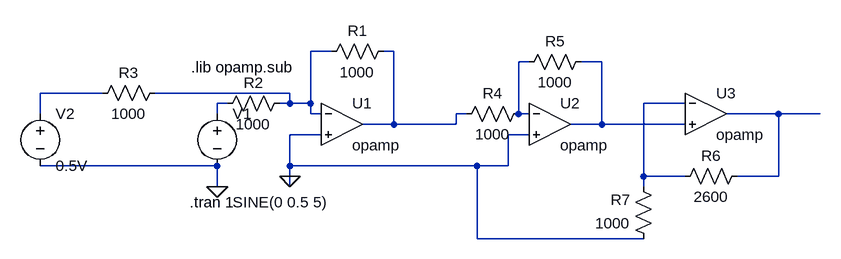
[diagram p0: schematic 3opamp_implementation.asc]
3opamp_implementation.asc, the LTspice schematic file:
Version 4
SHEET 1 932 680
WIRE 176 48 144 48
WIRE 272 48 256 48
WIRE 480 64 464 64
WIRE 592 64 560 64
WIRE -176 112 -272 112
WIRE 112 112 -96 112
WIRE 16 128 0 128
WIRE 112 128 112 112
WIRE 112 128 96 128
WIRE 144 128 144 48
WIRE 144 128 112 128
WIRE 720 128 656 128
WIRE -272 144 -272 112
WIRE 0 144 0 128
WIRE 144 144 144 128
WIRE 160 144 144 144
WIRE 384 144 368 144
WIRE 464 144 464 64
WIRE 480 144 464 144
WIRE 864 144 784 144
WIRE 928 144 864 144
WIRE 272 160 272 48
WIRE 272 160 224 160
WIRE 368 160 368 144
WIRE 368 160 272 160
WIRE 592 160 592 64
WIRE 592 160 544 160
WIRE 720 160 592 160
WIRE 160 176 112 176
WIRE 480 176 448 176
WIRE 0 224 -272 224
WIRE 112 224 112 176
WIRE 400 224 112 224
WIRE 448 224 448 176
WIRE 448 224 400 224
WIRE 112 240 112 224
WIRE 656 240 656 128
WIRE 720 240 656 240
WIRE 864 240 864 144
WIRE 864 240 800 240
WIRE 0 256 0 224
WIRE 112 256 112 240
WIRE 656 256 656 240
WIRE 400 336 400 224
WIRE 656 336 400 336
FLAG 0 256 0
FLAG 112 240 0
SYMBOL Opamps\\opamp 192 96 R0
SYMATTR InstName U1
SYMBOL voltage 0 128 R0
WINDOW 3 24 152 Left 2
WINDOW 123 24 124 Left 2
WINDOW 39 0 0 Left 0
SYMATTR InstName V1
SYMATTR Value SINE(0 0.5 5)
SYMBOL res 272 32 R90
WINDOW 0 0 56 VBottom 2
WINDOW 3 32 56 VTop 2
SYMATTR InstName R1
SYMATTR Value 1000
SYMBOL res 112 112 R90
WINDOW 0 0 56 VBottom 2
WINDOW 3 32 56 VTop 2
SYMATTR InstName R2
SYMATTR Value 1000
SYMBOL res -80 96 R90
WINDOW 0 0 56 VBottom 2
WINDOW 3 32 56 VTop 2
SYMATTR InstName R3
SYMATTR Value 1000
SYMBOL voltage -272 128 R0
WINDOW 123 0 0 Left 0
WINDOW 39 0 0 Left 0
SYMATTR InstName V2
SYMATTR Value 0.5V
SYMBOL Opamps\\opamp 512 96 R0
SYMATTR InstName U2
SYMBOL res 480 128 R90
WINDOW 0 0 56 VBottom 2
WINDOW 3 32 56 VTop 2
SYMATTR InstName R4
SYMATTR Value 1000
SYMBOL res 576 48 R90
WINDOW 0 0 56 VBottom 2
WINDOW 3 32 56 VTop 2
SYMATTR InstName R5
SYMATTR Value 1000
SYMBOL Opamps\\opamp 752 80 R0
SYMATTR InstName U3
SYMBOL res 816 224 R90
WINDOW 0 0 56 VBottom 2
WINDOW 3 32 56 VTop 2
SYMATTR InstName R6
SYMATTR Value 2600
SYMBOL res 672 352 R180
WINDOW 0 36 76 Left 2
WINDOW 3 36 40 Left 2
SYMATTR InstName R7
SYMATTR Value 1000
TEXT -40 72 Left 2 !.lib opamp.sub
TEXT -42 280 Left 2 !.tran 1

The netlist it stands for:
* 3opamp_implementation.asc
XU1 N001 0 N002 opamp Aol=100K GBW=10Meg  ; pins invin noninvin out
V1 N006 0 SINE(0 0.5 5)
R1 N002 N001 1000
R2 N001 N006 1000
R3 N001 N005 1000
V2 N005 0 0.5V
XU2 N003 0 N004 opamp Aol=100K GBW=10Meg  ; pins invin noninvin out
R4 N003 N002 1000
R5 N004 N003 1000
XU3 N007 N004 N008 opamp Aol=100K GBW=10Meg  ; pins invin noninvin out
R6 N008 N007 2600
R7 0 N007 1000
.lib opamp.sub
.tran 1
.backanno
.end